# Altium schematic sheet REG3V3.SchDoc
size A; SheetNumber: 2; SheetTotal: 10
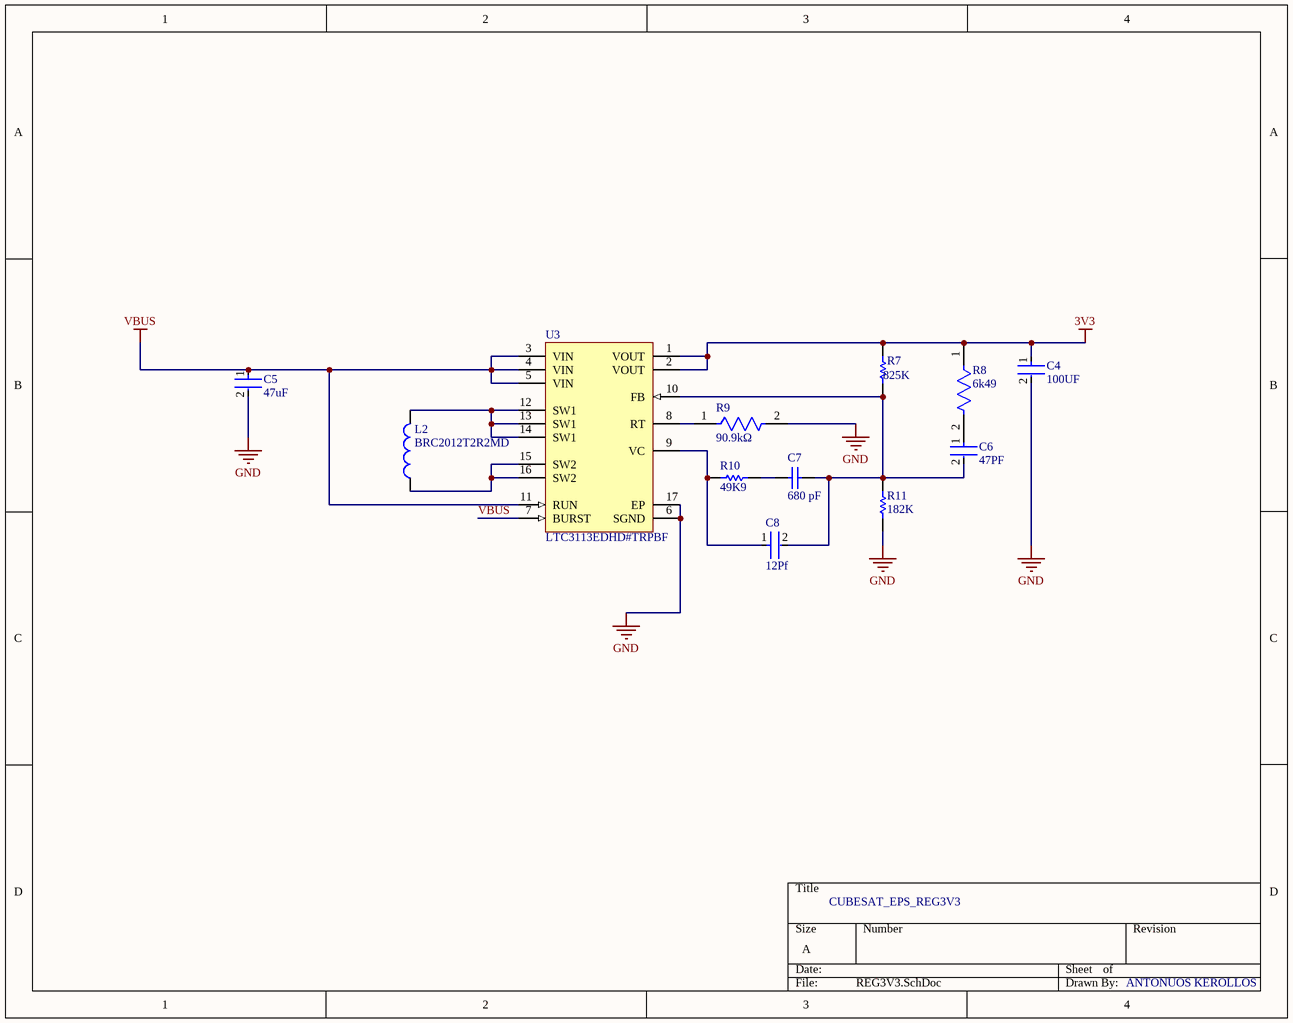
[diagram p0: REG3V3.SchDoc]

## Parts
C4  100UF  [FP-C1210C-FS-MFG]
C5  47uF  [FP-C3216-160-0_2-MFG]
C6  47PF  [FP-C0805C-DN-MFG]
C7  680 pF  [CAPC1005X55X25ML05T10]
C8  12Pf  [FP-C0603C-CF-MFG]
L2  BRC2012T2R2MD  [INDC2013X140X50LL20T20]
R7  825K  [RESC1005X40X25NL05T05]
R8  6k49  [FP-ERJ2RK-MFG]
R9  90.9kΩ  [FP-CRCW0402-e3-IPC_B]
R10  49K9  [RESC1005X40X25LL05T05]
R11  182K  [RESC1005X40X25ML05T05]
U3  LTC3113EDHD#TRPBF  [LT-DHD-16_V]

## Nets
3V3: C4.1 R7.2 R8.1 U3.1(VOUT) U3.2(VOUT)
GND: C4.2 C5.2 R9.2 R11.2 U3.6(SGND) U3.17(EP)
VBUS: C5.1 U3.3(VIN) U3.4(VIN) U3.5(VIN) U3.7(BURST) U3.11(RUN)
NetC6_1: C6.1 R8.2
NetC6_2: C6.2 C7.2 C8.2 R7.1 R11.1 U3.10(FB)
NetC7_1: C7.1 R10.2
NetC8_1: C8.1 R10.1 U3.9(VC)
NetL2_1: L2.1 U3.15(SW2) U3.16(SW2)
NetL2_2: L2.2 U3.12(SW1) U3.13(SW1) U3.14(SW1)
NetR9_1: R9.1 U3.8(RT)

## Notes on the sheet
- CUBESAT_EPS_REG3V3
- ANTONUOS KEROLLOS

## Library data of the parts
C4 = CMP-03020-034653-1: CAP CER 100UF 16V X5R 1210; Tolerance: 20%; Dielectric Material: Ceramic; Max Operating Temperature: 85°C; REACH SVHC: No SVHC; Case Code (Metric): 3225; Case/Package: 1210; Thickness: 0.106inch; Length: 3.2mm; Min Operating Temperature: -55°C; Voltage Rating (DC): 16V; Weight: 0.000564oz; Packaging: Tape and Reel; Case Code (Imperial): 1210; Depth: 2.5mm; Lead Free: Lead Free; Width: 0.098inch; Voltage Rating: 16V; Capacitance: 100uF; Termination: SMD/SMT; Dielectric: X5R; Package Quantity: 1000
C5 = CMP-2000-05397-3: Multilayer Ceramic Capacitors 47uF ±20% 25V X5R SMD 1206; Weight: 0.000571oz; Dielectric: X5R; Length: 0.126inch; Voltage Rating: 25V; Case/Package: 1206; Dielectric Material: Ceramic; Min Operating Temperature: -55°C; Lead Free: Lead Free; Packaging: Tape and Reel; Package Quantity: 1; Mount: Surface Mount; Depth: 1.6mm; REACH SVHC: No SVHC; Termination: SMD/SMT; Case Code (Imperial): 1206; Series: C; Resistor Type: Ceramic; Voltage: 25V; Width: 0.063inch; Height: 1.6mm; Tolerance: 20%; Capacitance: 47uF; Max Operating Temperature: 85°C; Voltage Rating (DC): 25V; RoHS Compliant: Yes; Thickness: 0.071inch; Case Code (Metric): 3216
C6 = CMP-2007-00435-2: CAP CER 47PF 50V C0G/NP0 0805; Manufacturer: KEMET; Manufacturer Part Number: C0805C470J5GACTU; Temperature Characteristic: C0G; Material: Ceramic; Temperature Coefficient: 30ppm/°C; Tolerance: 0.05; Temperature Range High: +125°C; Device Class L1: Passive Components; Device Class L3: Ceramic Capacitors; Lead Free: Yes; Temperature: -55°C to +125°C; Capacitance: 47 pF; Height: 0.88mm; Octopart: https://octopart.com/c0805c470j5gactu-kemet-150274; RoHS: TRUE; Category: Cap; Voltage Rating: 50 V; Automotive: No; Device Class L2: Capacitors; Value: 47 pF; Ipc Land Pattern Name: CAPC200125X78; Temperature Range Low: -55°C; Mouser Description: Multilayer Ceramic Capacitors MLCC - SMD/SMT 50volts 47pF C0G 5%; Package: C0805C-DN; Digikey Description: CAP CER 47PF 50V C0G/NP0 0805; ComponentLink2URL: https://content.kemet.com/datasheets/KEM_C1003_C0G_SMD.pdf; ComponentLink2Description: Datasheet
C7 = CMP-2008-04665-4: Chip Capacitor, 680 pF, +/- 10%, 50 V, -55 to 125 degC, 0402 (1005 Metric), RoHS, Tape and Reel; Manufacturer: Basic Passives; PartNumber: GRM155R71H681KA01D; Voltage Rating: 50 V; Type (Capacitors): X7R; Case\/Package: 0402; ComponentLink1Description: Manufacturer URL; Capacitance: 680 pF; Mount: Surface Mount; Length: 1 mm; Max Operating Temperature: 125 degC; PackageDescription: 2-Pin Surface Mount Device, Body 1 x 0.5 mm; Width: 0.5 mm; Tolerance: 10%; ComponentLink2URL: http://search.murata.co.jp/Ceramy/image/img/A01X/G101/ENG/GRM155R71H681KA01-01.pdf; RoHSCompliant: true; Package Quantity: 10000; ComponentLink2Description: Datasheet; Case Code (Metric): 1005; Min Operating Temperature: -55 degC; PackageReference: 0402; Case Code (Imperial): 0402; Height: 0.5 mm; Radiation Hardening: No; Mounting Technology: Surface Mount; Pins: 2; Packaging: Tape and Reel; Lead Pitch: 2 mm; Voltage Rating (DC): 50 V; ComponentLink1URL: http://www.murata.com/; DatasheetVersion: 02/2016
C8 = CMP-2006-03703-3: Ceramic Capacitor 12Pf 50V, C0G, 5%, 0603, Full Reel; Manufacturer: KEMET; Manufacturer Part Number: C0603C120J5GACTU; Automotive Grade: Grade 1; Temperature Coefficient: 30ppm/°C; Tolerance: 0.05; Temperature Range High: +125°C; Temperature Characteristic: C0G; Temperature Range Low: -55°C; Voltage Rating: 50 V; Mouser Description: Ceramic Capacitor 12Pf 50V, C0G, 5%, 0603, Full Reel; Package: C0603C-CF; Temperature: -55°C to +125°C; Device Class L3: Ceramic Capacitors; Value: 12 pF; Material: Ceramic; Lead Free: Yes; ComponentLink2URL: https://api.kemet.com/component-edge/download/datasheet/C0603C100J5GACAUTO.pdf; Category: Cap; Capacitance: 12 pF; ComponentLink2Description: Datasheet; Device Class L1: Passive Components; Height: 0.87mm; Device Class L2: Capacitors; Digikey Description: Ceramic Capacitor 12Pf 50V, C0G, 5%, 0603, Full Reel; RoHS: TRUE; Octopart: https://octopart.com/c0603c120j5gactu-kemet-108780; Automotive: Yes
L2 = CMP-2000-05964-1: Wire-Wound Chip Power Inductor, 2.2 uH, +/- 20%, -40 to 105 degC, 2-Pin SMD (0805), RoHS, Tape and Reel; Manufacturer: Taiyo Yuden; Inductance: 2.2µH; Other Names: 587-2905-2 / LQBRC2012T2R2MD; Type: Wirewound; Current - Saturation: 1.1A; Online Catalog: BRSeries; EDA / CAD Models: DownloadfromAcceleratedDesigns; Shielding: Unshielded; DC Resistance (DCR): 143mOhmMax; Current Rating: 1A; Frequency - Test: 1MHz; Frequency - Self Resonant: 350MHz; Series: BR; Size / Dimension: 0.079"Lx0.049"W(2.00mmx1.25mm); Datasheet URL: http://ds.yuden.co.jp/TYCOMPAS/ut/detail.do?productNo=BRC2012T2R2MD&fileName=BRC2012T2R2MD_SS&mode=specSheetDownload; Tolerance: ±20%; Mounting Technology: SurfaceMount; Standard Package: 2,000; Category: Inductors,Coils,Chokes; Operating Temperature: -40°C~105°C; Mounting Type: SurfaceMount; Height - Seated (Max): 0.055"(1.40mm); Datasheet Version: 09/2016; Package Reference: 0805; Package Description: 2-Pin Surface Mount Device, Body 2 x 1.25 mm; Packaging: Tape&Reel(TR); Package / Case: 0805(2012Metric); Family: FixedInductors; Manufacturer URL: http://www.t-yuden.com/
R7 = CMP-2002-00233-1: Manufacturer: Vishay Dale; Part Number: CRCW0402825KFKED
R8 = CMP-2002-01028-2: NexarPartId: 55421257; Max Power Dissipation: 100mW; Resistance: 6.49kΩ; Voltage Rating: 50V; Tolerance: 1%; Temperature Coefficient: 100ppm/°C; RoHS: Compliant; Number of Terminations: 2; Case Code (Metric): 1005; Schedule B: 8533210045, 8533210045; Composition: Thick Film; Lead Free: Lead Free; Length: 1mm; Voltage Rating (DC): 50V; Max Operating Temperature: 155°C; Width: 508µm; Case Code (Imperial): 0402; REACH SVHC: No SVHC; Depth: 500µm; Contact Plating: Tin; Power Rating: 100mW; Military Standard: Not; Termination: SMD/SMT; Case/Package: 0402; Min Operating Temperature: -55°C; Packaging: Cut Tape; Height: 406.4µm; Lifecycle Status: Production; Mount: Surface Mount
R9 = CMP-2002-00265-2: RES Thick Film, 90.9kΩ, 1%, 0.063W, 100ppm/°C, 0402; Voltage Rating (DC): 50V; Resistance: 90.9kR; Power Rating: 63mW; Case Code (Imperial): 0402; Packaging: Tape and Reel; Number of Pins: 2; Height: 0.35mm; Military Standard: Not; Min Operating Temperature: -55°C; Depth: 0.5mm; Contact Plating: Tin; Radiation Hardening: No; Termination: SMD/SMT; Lead Free: Lead Free; Case/Package: 0402; Temperature Coefficient: 100ppm/°C; Composition: Thick Film; Case Code (Metric): 1005; Weight: 2.3E-05oz; Number of Terminations: 2; Max Operating Temperature: 155°C; Length: 1mm; Max Power Dissipation: 63mW; Voltage Rating: 50V; Tolerance: 1%; Mount: Surface Mount; Features: Automotive AEC-Q200; Package Quantity: 10; Width: 0.02inch
R10 = CMP-2002-00039-1: Part Number: CRCW040249K9FKED; Manufacturer: Vishay Dale
R11 = CMP-2002-08256-1: Manufacturer: Vishay Dale; Part Number: CRCW0402182KFKED
U3 = CMP-0492-00444-1: 3 A Low Noise Buck-Boost DC/DC Converter, 16-pin SON (DHD-16), -40 to 125 degC, Pb-Free, Tape and Reel; Manufacturer: Linear Technology; Frequency Sync Range: 300kHz - 2MHz; Number of Outputs: 1; Mounting Technology: Surface Mount; ComponentLink3URL: http://cds.linear.com/docs/en/packaging/DFN_16_05-08-1707.pdf; PackageReference: DHD-16; PackageVersion: Jun-10; ComponentLink3Description: Package Specification; RoHS: TRUE; ComponentLink2Description: Datasheet; Code_JEDEC: MO-229; ComponentLink2URL: http://cds.linear.com/docs/en/datasheet/3113f.pdf; PartNumber: LTC3113EDHD#TRPBF; Packing: Tape and Reel; ComponentLink1Description: Manufacturer URL; PackageDescription: 16-Pin Plastic DFN, Body 5 x 4 mm, Pitch 0.5 mm; ComponentLink1URL: http://www.linear.com/